# Altium schematic sheet Microcontroller.SchDoc
size 431 x 279 mm; SheetNumber: 4; SheetTotal: 6
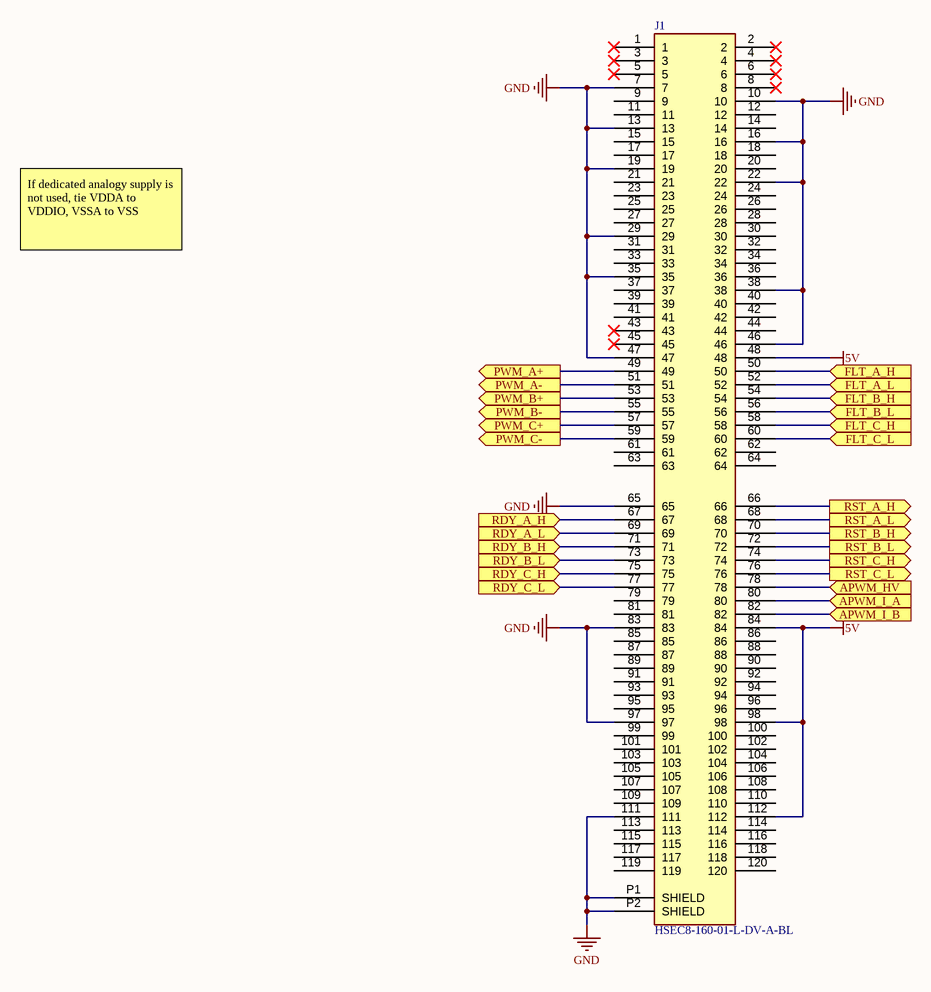
[diagram p0: Microcontroller.SchDoc]

## Parts
J1  HSEC8-160-01-L-DV-A-BL  [SAMTEC_HSEC8-160-01-L-DV-A-BL]

## Ports
APWM_HV (in), APWM_I_A (in), APWM_I_B (in), FLT_A_H (in), FLT_A_L (in), FLT_B_H (in), FLT_B_L (in), FLT_C_H (in), FLT_C_L (in), PWM_A+ (out), PWM_A- (out), PWM_B+ (out), PWM_B- (out), PWM_C+ (out), PWM_C- (out), RDY_A_H (in), RDY_A_L (in), RDY_B_H (in), RDY_B_L (in), RDY_C_H (in), RDY_C_L (in), RST_A_H (out), RST_A_L (out), RST_B_H (out), RST_B_L (out), RST_C_H (out), RST_C_L (out)

## Nets
5V: J1.48 J1.84 J1.98 J1.112
GND: J1.7 J1.10 J1.13 J1.16 J1.19 J1.22 J1.29 J1.35 J1.38 J1.46 J1.47 J1.65 J1.83 J1.97 J1.111 J1.P1(SHIELD) J1.P2(SHIELD)
APWM_HV: J1.78 ; port APWM_HV
APWM_I_A: J1.80 ; port APWM_I_A
APWM_I_B: J1.82 ; port APWM_I_B
FLT_A_H: J1.50 ; port FLT_A_H
FLT_A_L: J1.52 ; port FLT_A_L
FLT_B_H: J1.54 ; port FLT_B_H
FLT_B_L: J1.56 ; port FLT_B_L
FLT_C_H: J1.58 ; port FLT_C_H
FLT_C_L: J1.60 ; port FLT_C_L
PWM_A+: J1.49 ; port PWM_A+
PWM_A-: J1.51 ; port PWM_A-
PWM_B+: J1.53 ; port PWM_B+
PWM_B-: J1.55 ; port PWM_B-
PWM_C+: J1.57 ; port PWM_C+
PWM_C-: J1.59 ; port PWM_C-
RDY_A_H: J1.67 ; port RDY_A_H
RDY_A_L: J1.69 ; port RDY_A_L
RDY_B_H: J1.71 ; port RDY_B_H
RDY_B_L: J1.73 ; port RDY_B_L
RDY_C_H: J1.75 ; port RDY_C_H
RDY_C_L: J1.77 ; port RDY_C_L
RST_A_H: J1.66 ; port RST_A_H
RST_A_L: J1.68 ; port RST_A_L
RST_B_H: J1.70 ; port RST_B_H
RST_B_L: J1.72 ; port RST_B_L
RST_C_H: J1.74 ; port RST_C_H
RST_C_L: J1.76 ; port RST_C_L

Not connected (* = marked no-connect by the designer): J1 1* 2* 3* 4* 5* 6* 8* 9 11 12 14 15 17 18 20 21 23 24 25 26 27 28 30 31 32 33 34 36 37 39 40 41 42 43* 44 45* 61 62 63 64 79 81 85 86 87 88 89 90 91 92 93 94 95 96 99 100 101 102 103 104 105 106 107 108 109 110 113 114 115 116 117 118 119 120

## Notes on the sheet
- If dedicated analogy supply is not used, tie VDDA to VDDIO, VSSA to VSS
- Title
- Project
- Scale
- Size
- B
- Part Number
- Engineer
- Sheet
- of
- Rev

## Library data of the parts
J1 = HSEC8-160-01-L-DV-A-BL: .8mm HIGH SPEED DUAL VERTICAL MOUNT EDGE CARD ASSEMBLY; MF: {'manufacturer': u'Samtec'}; MP: HSEC8-160-01-L-DV-A-BL; Value: *; Price: None; Availability: Unavailable; Package: None